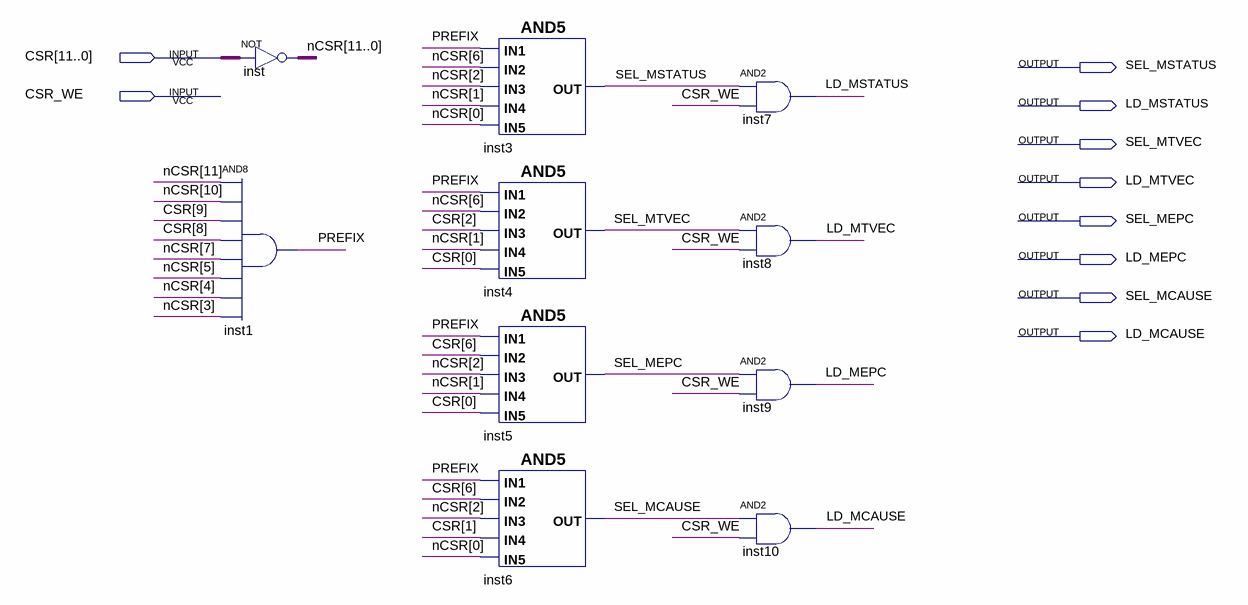
[diagram p0: schematic sheet]
// Quartus schematic CSRDecoder.bdf as structural Verilog: 10 symbols, 10 pins
module CSRDecoder (
  input  [11:0] CSR,
  input  CSR_WE,
  output SEL_MSTATUS,
  output LD_MSTATUS,
  output SEL_MTVEC,
  output LD_MTVEC,
  output SEL_MEPC,
  output LD_MEPC,
  output SEL_MCAUSE,
  output LD_MCAUSE
);

  wire PREFIX;
  wire [11:0] nCSR;

  assign nCSR = ~CSR;  // NOT inst, 12 bits wide
  and inst1 (PREFIX, nCSR[11], nCSR[10], CSR[9], CSR[8], nCSR[7], nCSR[5], nCSR[4], nCSR[3]);
  and inst3 (SEL_MSTATUS, PREFIX, nCSR[6], nCSR[2], nCSR[1], nCSR[0]);
  and inst4 (SEL_MTVEC, PREFIX, nCSR[6], CSR[2], nCSR[1], CSR[0]);
  and inst5 (SEL_MEPC, PREFIX, CSR[6], nCSR[2], nCSR[1], CSR[0]);
  and inst6 (SEL_MCAUSE, PREFIX, CSR[6], nCSR[2], CSR[1], nCSR[0]);
  and inst7 (LD_MSTATUS, SEL_MSTATUS, CSR_WE);
  and inst8 (LD_MTVEC, SEL_MTVEC, CSR_WE);
  and inst9 (LD_MEPC, SEL_MEPC, CSR_WE);
  and inst10 (LD_MCAUSE, SEL_MCAUSE, CSR_WE);
endmodule
